# EAGLE design testboard1 (EAGLE 9.2.2)

## Sheet 1 of 2

## Sheet 2 of 2
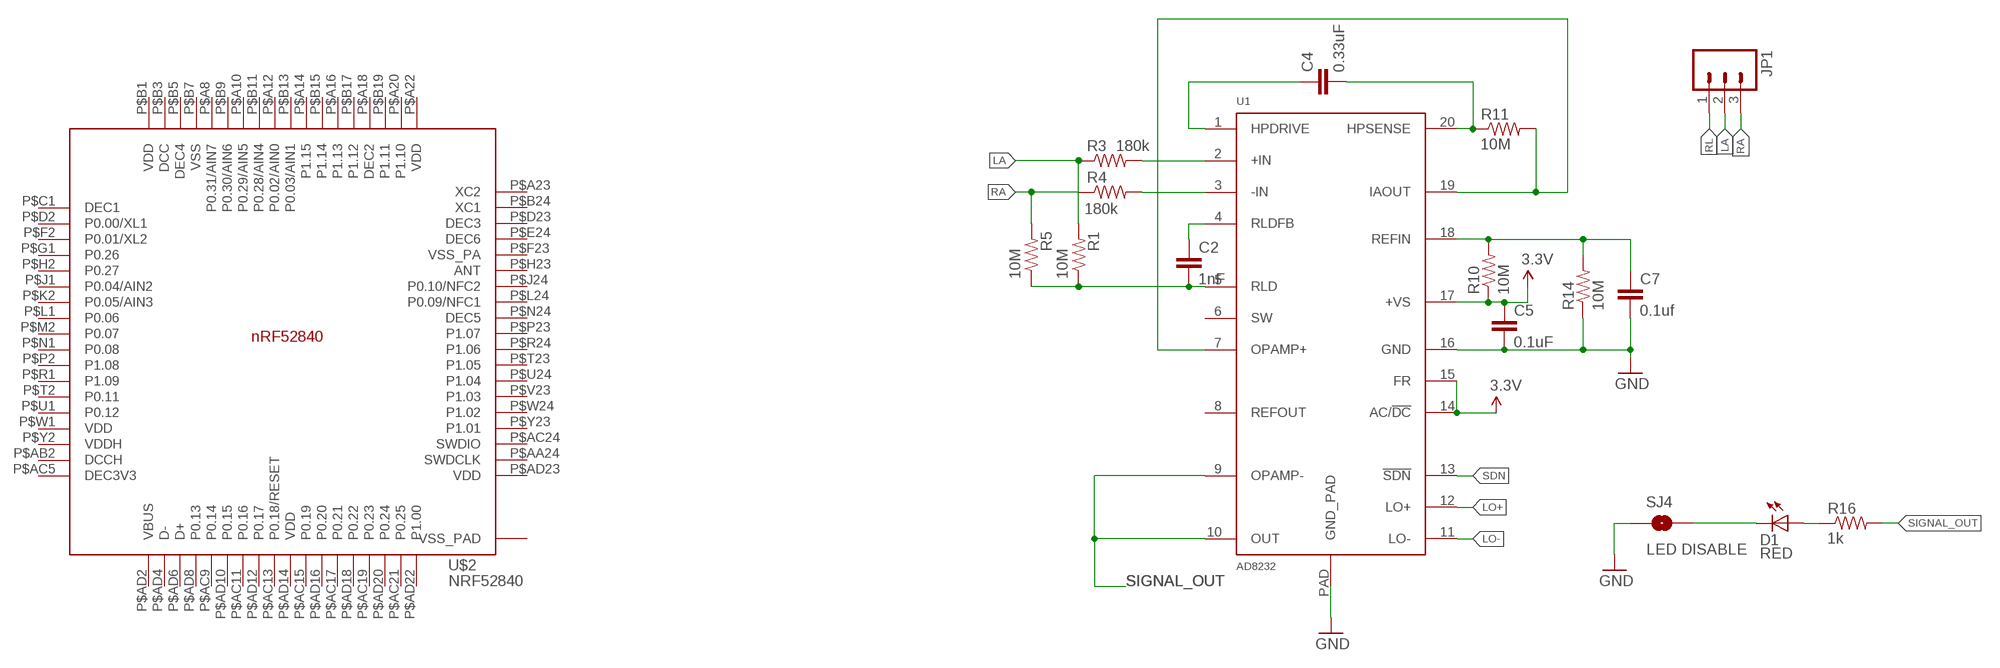
[diagram p0: schematic, sheet 2]

### Parts
C2  1nF  CAP0603-CAP  [0603-CAP]
C4  0.33uF  CAP0805  [0805]
C5  0.1uF  CAP0603-CAP  [0603-CAP]
C7  0.1uf  CAP0603-CAP  [0603-CAP]
D1  RED  LED-RED0603  [LED-0603]
JP1  M03PTH  [1X03]
R1  10M  RESISTOR0603-RES  [0603-RES]
R3  180k  RESISTOR0603-RES  [0603-RES]
R4  180k  RESISTOR0603-RES  [0603-RES]
R5  10M  RESISTOR0603-RES  [0603-RES]
R10  10M  RESISTOR0603-RES  [0603-RES]
R11  10M  RESISTOR0603-RES  [0603-RES]
R14  10M  RESISTOR0603-RES  [0603-RES]
R16  1k  1K-1%  [0603-RES]
SJ4  LED DISABLE  SOLDERJUMPERTRACE  [SJ_2S-TRACE]
U1  AD8232  [LFCSP_20]
U$2  NRF52840  [AQFN50P700X700X85_HS-74N]

### Nets
3.3V: C5.1 R10.1 U1.14(AC/!DC) U1.15(FR) U1.17(+VS)
GND: C5.2 C7.2 R14.1 SJ4.1 U1.16(GND) U1.PAD(GND_PAD)
LA: JP1.2 R1.2 R3.1
LO+: U1.12(LO+)
LO-: U1.11(LO-)
N$1: R3.2 U1.2(+IN)
N$2: R4.2 U1.3(-IN)
N$4: C4.2 R11.1 U1.20(HPSENSE)
N$5: C7.1 R10.2 R14.2 U1.18(REFIN)
N$6: D1.A R16.1
N$10: D1.C SJ4.2
N$13: C4.1 U1.1(HPDRIVE)
N$17: C2.1 U1.4(RLDFB)
N$18: C2.2 R1.1 R5.1 U1.5(RLD)
RA: JP1.3 R4.1 R5.2
RL: JP1.1
SDN: U1.13(!SDN)
SIGNAL_OUT: R11.2 R16.2 U1.7(OPAMP+) U1.9(OPAMP-) U1.10(OUT) U1.19(IAOUT)
Unconnected: U1.6(SW) U1.8(REFOUT) U$2.P$74(VSS_PAD) U$2.P$75(VSS_PAD) U$2.P$76(VSS_PAD) U$2.P$77(VSS_PAD) U$2.P$78(VSS_PAD) U$2.P$79(VSS_PAD) U$2.P$80(VSS_PAD) U$2.P$81(VSS_PAD) U$2.P$82(VSS_PAD) U$2.P$83(VSS_PAD) U$2.P$84(VSS_PAD) U$2.P$85(VSS_PAD) U$2.P$86(VSS_PAD) U$2.P$87(VSS_PAD) U$2.P$88(VSS_PAD) U$2.P$89(VSS_PAD) U$2.P$90(VSS_PAD) U$2.P$A8(P0.31/AIN7) U$2.P$A10(P0.29/AIN5) U$2.P$A12(P0.02/AIN0) U$2.P$A14(P1.15) U$2.P$A16(P1.13) U$2.P$A18(DEC2) U$2.P$A20(P1.10) U$2.P$A23(XC2) U$2.P$AA24(SWDCLK) U$2.P$AB2(DCCH) U$2.P$AC5(DEC3V3) U$2.P$AC9(P0.14) U$2.P$AC11(P0.16) U$2.P$AC13(P0.18/RESET) U$2.P$AC15(P0.19) U$2.P$AC17(P0.21) U$2.P$AC19(P0.23) U$2.P$AC21(P0.25) U$2.P$AC24(SWDIO) U$2.P$AD4(D-) U$2.P$AD6(D+) U$2.P$AD8(P0.13) U$2.P$AD10(P0.15) U$2.P$AD12(P0.17) U$2.P$AD16(P0.20) U$2.P$AD18(P0.22) U$2.P$AD20(P0.24) U$2.P$AD22(P1.00) U$2.P$B3(DCC) U$2.P$B9(P0.30/AIN6) U$2.P$B11(P0.28/AIN4) U$2.P$B13(P0.03/AIN1) U$2.P$B15(P1.14) U$2.P$B17(P1.12) U$2.P$B19(P1.11) U$2.P$B24(XC1) U$2.P$D2(P0.00/XL1) U$2.P$D23(DEC3) U$2.P$E24(DEC6) U$2.P$F2(P0.01/XL2) U$2.P$F23(VSS_PA) U$2.P$G1(P0.26) U$2.P$H2(P0.27) U$2.P$H23(ANT) U$2.P$J1(P0.04/AIN2) U$2.P$J24(P0.10/NFC2) U$2.P$K2(P0.05/AIN3) U$2.P$L1(P0.06) U$2.P$L24(P0.09/NFC1) U$2.P$M2(P0.07) U$2.P$N1(P0.08) U$2.P$N24(DEC5) U$2.P$P2(P1.08) U$2.P$P23(P1.07) U$2.P$R1(P1.09) U$2.P$R24(P1.06) U$2.P$T2(P0.11) U$2.P$T23(P1.05) U$2.P$U1(P0.12) U$2.P$U24(P1.04) U$2.P$V23(P1.03) U$2.P$W24(P1.02) U$2.P$Y23(P1.01)

## Power pins joined to a net without a drawn wire
DEC1: U$2.P$C1(DEC1)
DEC4: U$2.P$B5(DEC4)
VBUS: U$2.P$AD2(VBUS)
VDD: U$2.P$A22(VDD) U$2.P$AD14(VDD) U$2.P$AD23(VDD) U$2.P$B1(VDD) U$2.P$W1(VDD)
VDDH: U$2.P$Y2(VDDH)
VSS: U$2.P$B7(VSS)

## Library data of the parts
C2 C4 C5 C7 = SparkFun-Passives:CAP: Capacitor Standard 0603 ceramic capacitor, and 0.1" leaded capacitor.
D1 = SparkFun-LED:LED-RED: Assorted Red LEDs LilyPad 1206- DIO-09912 1206- DIO-00809 0603- DIO-00819; PROD_ID: DIO-00819
JP1 = SparkFun-Connectors:M03: Header 3 Standard 3-pin 0.1" header. Use with straight break away headers (SKU : PRT-00116), right angle break away headers (PRT-00553), swiss pins (PRT-00743), machine pins (PRT-00117), and female headers (PRT-00115). Molex polarized connector foot print use with SKU : PRT-08232 with associated crimp pins and housings.
R1 R3-R5 R10 R11 R14 = SparkFun-Passives:RESISTOR: Resistor Basic schematic elements and footprints for 0603, 1206, and PTH resistors.
R16 = SparkFun-Resistors:1K-1%: 1k-ohm SMT 1/10W - 1% (0603) RES-07856; PROD_ID: RES-07856
SJ4 = SparkFun-Passives:SOLDERJUMPER: Solder Jumper Standard SMD solder jumper. Used to automate production. Two varients : Normally Open and Normally Closed are the same, but have different paste layers. NC will have a large amount of paste and should jumper during reflow.
U1 = AD8232:AD8232
U$2 = Nordic_nRF:NRF52840: nRF52840 Features Advanced Single chip 2.4 GHz multi-protocol SoC 32-bit ARM Cortex-M4F Processor 1.7v to 5.5v operation 1MB flash + 256kB RAM Bluetooth 5 support for long range and high throughput 802.15.4 radio support On-chip NFC PPI –Programmable Peripheral Interconnect Automated power management system with automatic power management of each peripheral Configurable I/O mapping for analog and digital I/O 48 x GPIO 1 x QSPI 4 x Master/Slave SPI 2 x Two-wire interface (I²C) I²S interface 2 x UART 4 x PWM USB 2.0 controller ARM TrustZone CryptoCell-310 Cryptographic and security module AES 128-bit ECB/CCM/AAR hardware accelerator Digital microphone interface (PDM) Quadrature decoder 12-bit ADC Low power comparator On-chip 50Ω balun On-air compatible with nRF52, nRF51 and nRF24 Series Applications Advanced high performance wearables Wearables for secure payments Virtual Reality/Augmented Reality systems Smart Home sensor networks Smart city sensor networks High performance HID controllers Internet of Things (IoT) sensor networks Smart door locks Smart lighting networks Connected white goods

## Board
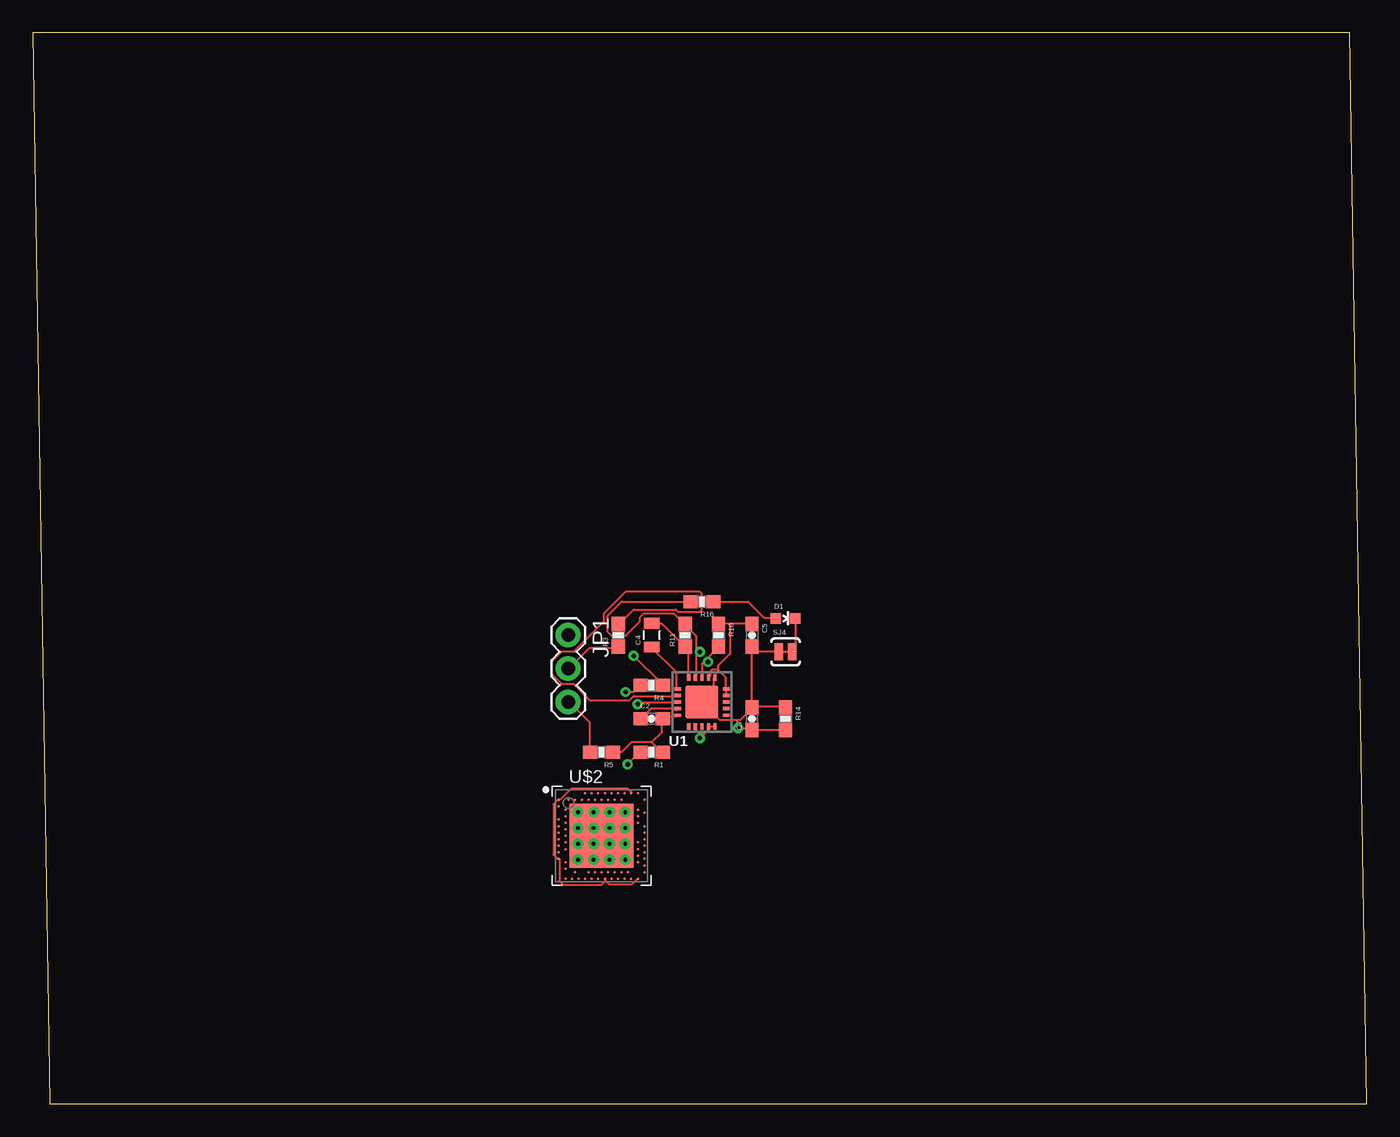
[diagram p1: board, top side]
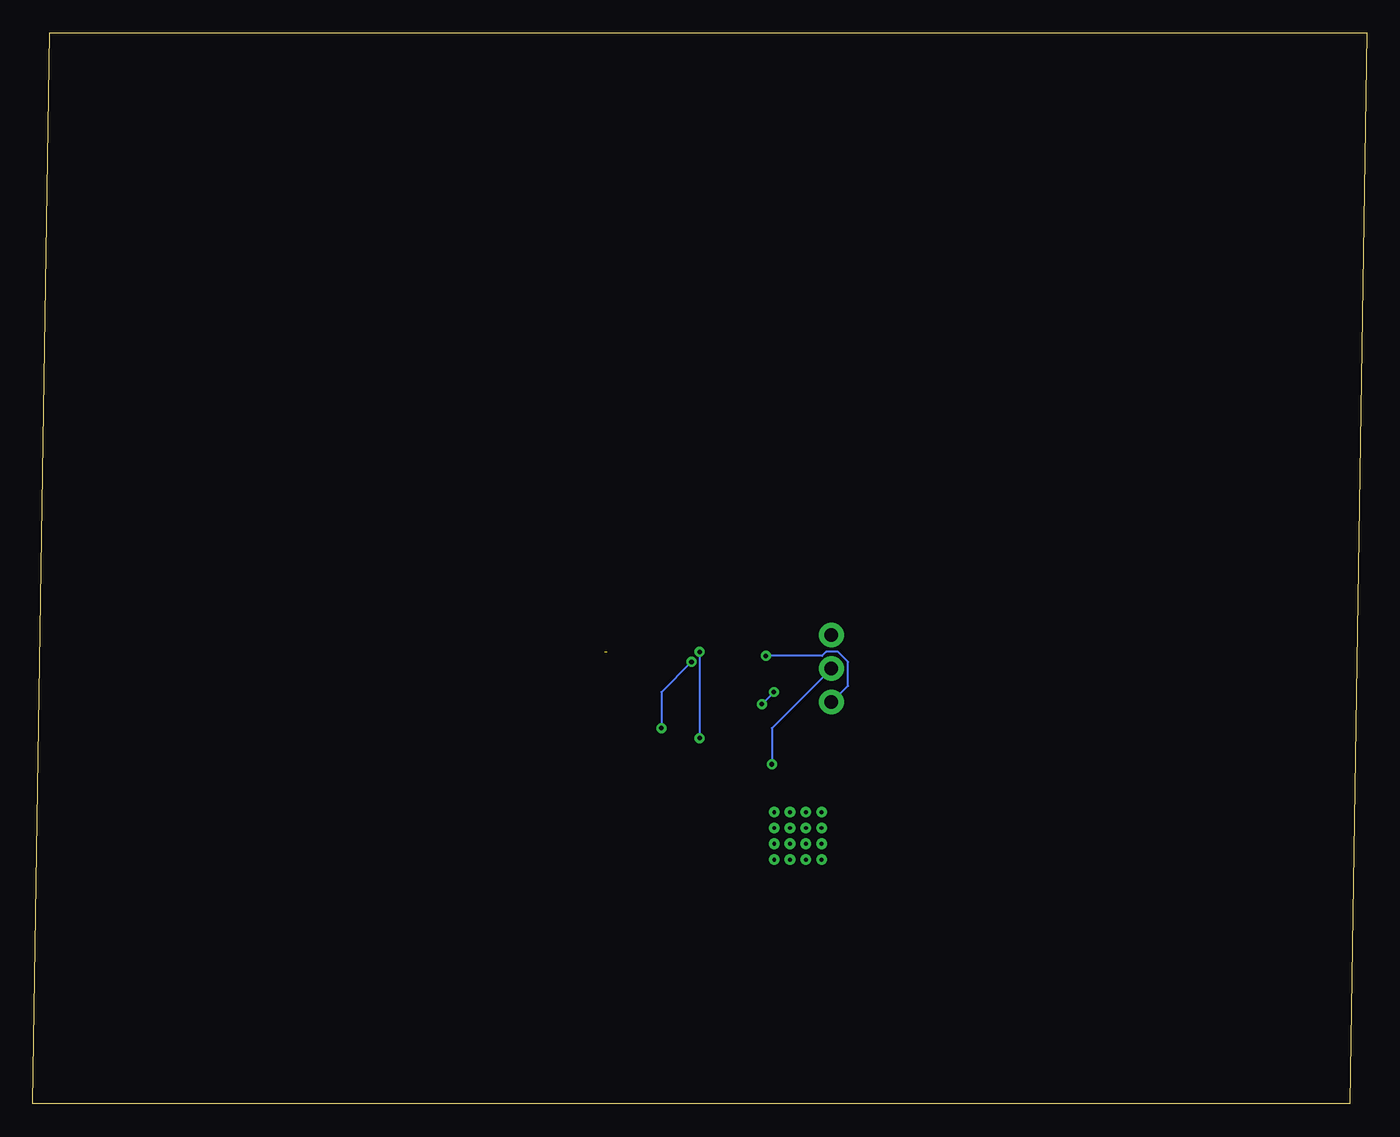
[diagram p2: board, bottom side, seen from below]

Size 101.27 x 81.27 mm. Coordinates in mm from the lower left corner, seen from the top.
Outline: 1.27,0 101.27,0 100,81.27 0,81.27 1.27,0
Copper layers (1*16): Top 0.035mm / dielectric 1.5mm / Bottom 0.035mm
Design rules "default": minimum track width 6mil, minimum drill 0.35mm, track to track 6mil, track to pad 6mil, pad to pad 6mil, via to via 6mil, smd to smd 6mil, copper to edge 40mil, drill to drill 6mil, minimum pad ring 10mil, minimum via ring 8mil, stop-mask expansion 4mil, vias tented up to drill 0mil, thermal gap 10mil

### Footprints (pad centres in the part's own frame; a part is rotated, then mirrored left to right if it is on the bottom)
0603-CAP = smd 1.1 x 1: 1 -0.85,0; 2 0.85,0
0805 = smd 0.8 x 1.2: 1 -0.9,0; 2 0.9,0
LED-0603 = smd 0.8 x 0.8: A 0,-0.75; C 0,0.75
1X03 = drill 1.016 pad 1.88: 1 0,0; 2 2.54,0; 3 5.08,0
0603-RES = smd 1.1 x 1: 1 -0.85,0; 2 0.85,0
SJ_2S-TRACE = smd 0.635 x 1.27: 1 -0.508,0; 2 0.508,0
LFCSP_20 = smd 0.5 x 0.25: 1 -1.85,1; 2 -1.85,0.5; 3 -1.85,0; 4 -1.85,-0.5; 5 -1.85,-1; 11 1.85,-1; 12 1.85,-0.5; 13 1.85,0; 14 1.85,0.5; 15 1.85,1 | smd 0.25 x 0.5: 6 -1,-1.85; 7 -0.5,-1.85; 8 0,-1.85; 9 0.5,-1.85; 10 1,-1.85; 16 1,1.85; 17 0.5,1.85; 18 0,1.85; 19 -0.5,1.85; 20 -1,1.85 | smd 2.5 x 2.5: PAD 0,0
AQFN50P700X700X85_HS-74N = smd 4.85 x 4.85: P$74 0,0 | drill 0.3 pad 0.6: P$75 -1.8,1.8; P$76 -0.6,1.8; P$77 0.6,1.8; P$78 1.8,1.8; P$79 -1.8,0.6; P$80 -0.6,0.6; P$81 0.6,0.6; P$82 1.8,0.6; P$83 -1.8,-0.6; P$84 -0.6,-0.6; P$85 0.6,-0.6; P$86 1.8,-0.6; P$87 -1.8,-1.8; P$88 -0.6,-1.8; P$89 0.6,-1.8; P$90 1.8,-1.8 | smd 0.2 x 0.2: P$A8 -1.25,3.25; P$A10 -0.75,3.25; P$A12 -0.25,3.25; P$A14 0.25,3.25; P$A16 0.75,3.25; P$A18 1.25,3.25; P$A20 1.75,3.25; P$A22 2.25,3.25; P$A23 2.75,3.25; P$AA24 3.25,-2.25; P$AB2 -2.75,-2.5; P$AC5 -2,-2.75; P$AC9 -1,-2.75; P$AC11 -0.5,-2.75; P$AC13 0,-2.75; P$AC15 0.5,-2.75; P$AC17 1,-2.75; P$AC19 1.5,-2.75; P$AC21 2,-2.75; P$AC24 3.25,-2.75; P$AD2 -2.75,-3.25; P$AD4 -2.25,-3.25; P$AD6 -1.75,-3.25; P$AD8 -1.25,-3.25; P$AD10 -0.75,-3.25; P$AD12 -0.25,-3.25; P$AD14 0.25,-3.25; P$AD16 0.75,-3.25; P$AD18 1.25,-3.25; P$AD20 1.75,-3.25; P$AD22 2.25,-3.25; P$AD23 2.75,-3.25; P$B1 -3.25,2.75; P$B3 -2.5,2.75; P$B5 -2,2.75; P$B7 -1.5,2.75; P$B9 -1,2.75; P$B11 -0.5,2.75; P$B13 0,2.75; P$B15 0.5,2.75; P$B17 1,2.75; P$B19 1.5,2.75; P$B24 3.25,2.75; P$C1 -3.25,2.25; P$D2 -2.75,2; P$D23 2.75,2; P$E24 3.25,1.75; P$F2 -2.75,1.5; P$F23 2.75,1.5; P$G1 -3.25,1.25; P$H2 -2.75,1; P$H23 2.75,1; P$J1 -3.25,0.75; P$J24 3.25,0.75; P$K2 -2.75,0.5; P$L1 -3.25,0.25; P$L24 3.25,0.25; P$M2 -2.75,0; P$N1 -3.25,-0.25; P$N24 3.25,-0.25; P$P2 -2.75,-0.5; P$P23 2.75,-0.5; P$R1 -3.25,-0.75; P$R24 3.25,-0.75; P$T2 -2.75,-1; P$T23 2.75,-1; P$U1 -3.25,-1.25; P$U24 3.25,-1.25; P$V23 2.75,-1.5; P$W1 -3.25,-1.75; P$W24 3.25,-1.75; P$Y2 -2.75,-2; P$Y23 2.75,-2

### Placement (x,y rotation side)
C2  46.99,29.21 0 top
C4  46.99,35.56 90 top
C5  54.61,35.56 270 top
C7  54.61,29.21 90 top
D1  57.15,36.83 270 top
JP1  40.64,35.56 270 top
R1  46.99,26.67 180 top
R3  44.45,35.56 90 top
R4  46.99,31.75 180 top
R5  43.18,26.67 180 top
R10  52.07,35.56 270 top
R11  49.53,35.56 90 top
R14  57.15,29.21 270 top
R16  50.8,38.1 180 top
SJ4  57.15,34.29 0 top
U1  50.8,30.48 0 top
U$2  43.18,20.32 0 top

### Tracks (layer width: path | path; a pad name or v marks a point on that pad's centre or on a via)
3.3V
  Top 0.152: 52.02,32.92 51.56,32.92 51.41,32.77 51.41,32.46 U1.17 | 52.02,32.92 52.63,32.31 52.63,31.55 U1.15 52.63,31.39 52.63,31.09 U1.14 | 52.93,36.42 54.61,36.42 C5.1 | 52.93,36.42 52.17,36.42 R10.1 | 52.02,32.92 52.02,33.22 52.93,34.14 52.93,36.42
GND
  Top 0.152: 54.56,34.59 C5.2 54.61,34.29 | U1.16 51.71,32.31 51.71,31.39 U1.PAD 52.17,29.11 53.7,29.11 54.61,30.02 C7.2 54.61,30.18 | 54.61,30.18 57.05,30.18 R14.1 | 54.61,30.18 54.61,34.29 | SJ4.1 54.61,34.29
LA  (via drill 0.35)
  Top 0.152: v45.16,25.76 46.08,26.67 R1.2 | R3.1 44.4,34.59 42.27,34.59 40.74,33.07 JP1.2
  Bottom 0.152: v45.16,25.76 45.16,28.5 JP1.2
N$1
  Top 0.152: 48.82,31.09 U1.2 48.82,30.94 45.62,30.94 45.31,30.63 42.27,30.63 41.05,31.85 40.13,31.85 39.37,32.61 39.37,33.53 40.13,34.29 41.05,34.29 43.33,36.58 43.33,37.19 45.01,38.86 50.65,38.86 50.8,38.71 50.8,37.49 50.65,37.34 48.97,37.34 48.82,37.49 45.62,37.49 44.55,36.42 R3.2
N$2  (via drill 0.35)
  Top 0.152: U1.3 46.08,30.48 v45.92,30.33 | v45.01,31.24 45.62,31.24 46.08,31.7 R4.2
  Bottom 0.152: v45.01,31.24 v45.92,30.33
N$4
  Top 0.152: U1.20 49.73,32.46 49.73,34.44 49.58,34.59 R11.1 49.43,34.75 47.75,36.42 46.99,36.42 C4.2
N$5  (via drill 0.35)
  Top 0.152: R14.2 57.05,28.35 54.61,28.35 C7.1 54.61,28.5 v53.54,28.5 | U1.18 50.8,33.38 51.11,33.68 | 51.11,33.68 52.02,34.59 R10.2 | 51.11,33.68 v51.26,33.53
  Bottom 0.152: v53.54,28.5 53.54,31.24 v51.26,33.53
N$6
  Top 0.152: 56.39,36.88 D1.A 56.29,36.88 55.52,36.88 54.3,38.1 R16.1
N$10  (1 unrouted)
  Top 0.152: D1.C 57.9,34.53 57.86,34.49 57.86,34.29
N$13
  Top 0.152: U1.1 48.82,31.55 48.82,32.77 46.99,34.59 C4.1
N$17
  Top 0.152: 48.82,29.87 U1.4 48.82,30.02 46.99,30.02 46.23,29.26 C2.1
N$18
  Top 0.152: U1.5 48.82,29.41 48.06,29.41 47.9,29.26 C2.2 47.75,29.11 47.75,28.19 46.99,27.43 | R5.1 44.7,26.67 45.47,27.43 46.99,27.43 | 46.99,27.43 47.75,26.67 R1.1
RA  (via drill 0.35)
  Top 0.152: R5.2 42.27,26.67 42.27,28.96 40.74,30.48 JP1.3 | v45.62,33.98 47.75,31.85 R4.1
  Bottom 0.152: v45.62,33.98 41.35,33.98 41.05,34.29 40.13,34.29 39.37,33.53 39.37,31.7 40.59,30.48 JP1.3
SIGNAL_OUT  (via drill 0.35)
  Top 0.152: U1.7 50.34,28.5 50.34,28.35 50.65,28.04 | 51.87,28.5 U1.10 51.71,28.65 51.41,28.65 U1.9 51.41,28.5 50.95,28.04 50.65,28.04 | 50.34,34.29 50.34,35.51 49.58,36.27 R11.2 49.43,36.42 48.67,37.19 46.38,37.19 46.08,36.88 46.08,36.58 45.01,35.51 43.94,35.51 43.64,35.81 43.64,37.03 44.7,38.1 R16.2 | 50.34,34.29 50.34,32.46 U1.19 | v50.65,27.74 50.65,28.04 | 50.34,34.29 v50.65,34.29
  Bottom 0.152: v50.65,34.29 v50.65,27.74
VDD
  Top 0.152: 43.49,16.92 43.49,17.07 U$2.P$AD14 | 43.49,16.92 43.79,16.61 45.47,16.61 U$2.P$AD23 | 39.98,18.59 39.83,18.59 39.52,18.9 39.52,22.71 39.83,23.01 39.98,23.01 | 39.98,23.01 40.89,23.93 45.16,23.93 45.47,23.62 U$2.P$A22 | 39.98,23.01 U$2.P$B1 | 43.49,16.92 43.18,16.61 40.28,16.61 39.98,16.92 39.98,18.59 | 39.98,18.59 U$2.P$W1